# Altium schematic sheet TempHumSensor.SchDoc
size A4; SheetNumber: 2; SheetTotal: 4
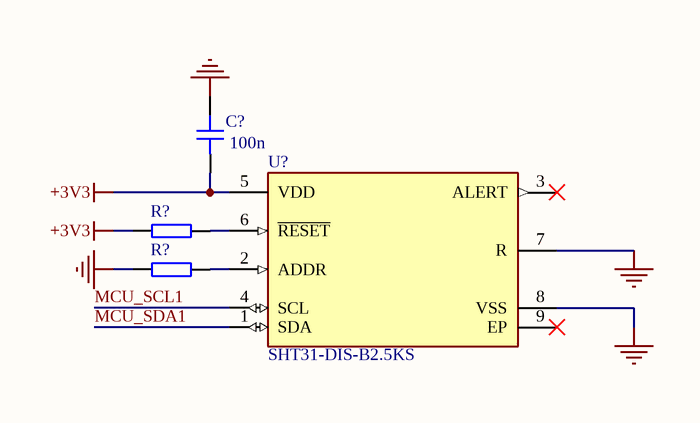
[diagram p0: TempHumSensor.SchDoc]

## Parts
(Parts that share a designator on the sheet are numbered #1, #2 ... from top to bottom, then left to right.)
C?  100n  [CAP_0402]
R?#1  10k  [RES_0402]  (value not drawn)
R?#2  10k  [RES_0402]  (value not drawn)
U?  SHT31-DIS-B2.5KS  [FP-SHT31-DIS-B2_5KS-MFG]

## Nets
+3V3: C?.1 R?#1.2 U?.5(VDD)
GND: C?.2 R?#2.2 U?.7(R) U?.8(VSS)
MCU_SCL1: U?.4(SCL)
MCU_SDA1: U?.1(SDA)
NetR?#1_1: R?#1.1 U?.6(~{RESET})
NetR?#2_1: R?#2.1 U?.2(ADDR)

Not connected (* = marked no-connect by the designer): U? 3(ALERT)* 9(EP)*

## Library data of the parts
C? = CAP_0402_16V: Capacitor SMD 0402 16V
R?#1 R?#2 = RES_0402: Resistor SMD 0402
U? = CMP-144040-000009-1: SENSOR HUMID/TEMP 5V I2C 2% SMD; RoHS Compliant: Yes